# Altium schematic sheet TopLevel.SchDoc: =project_title
size Tabloid; PageSetup: Record=PageOptions|CenterHorizontal=True|CenterVertical=True|PrintScale=0.73|XCorrection=1.00|YCorrection=1.00|PrintKind=0|BorderSize=5000000|LeftOffset=0|BottomOffset=0|Orientation=2|PaperLength=1000|PaperWidth=1000|Scale=100|PaperSource=7|PrintQuality=-4|MediaType=1|DitherType=10|PaperKind=A4|PrintScaleMode=1; CompanyName: Luxonis Holding; Organization: Luxonis Holding; Address1: 1925 Harmony Park Drive; Address2: Westminster, CO; Address3: 80234; Address4: United States; SheetNumber: 2; SheetTotal: 9
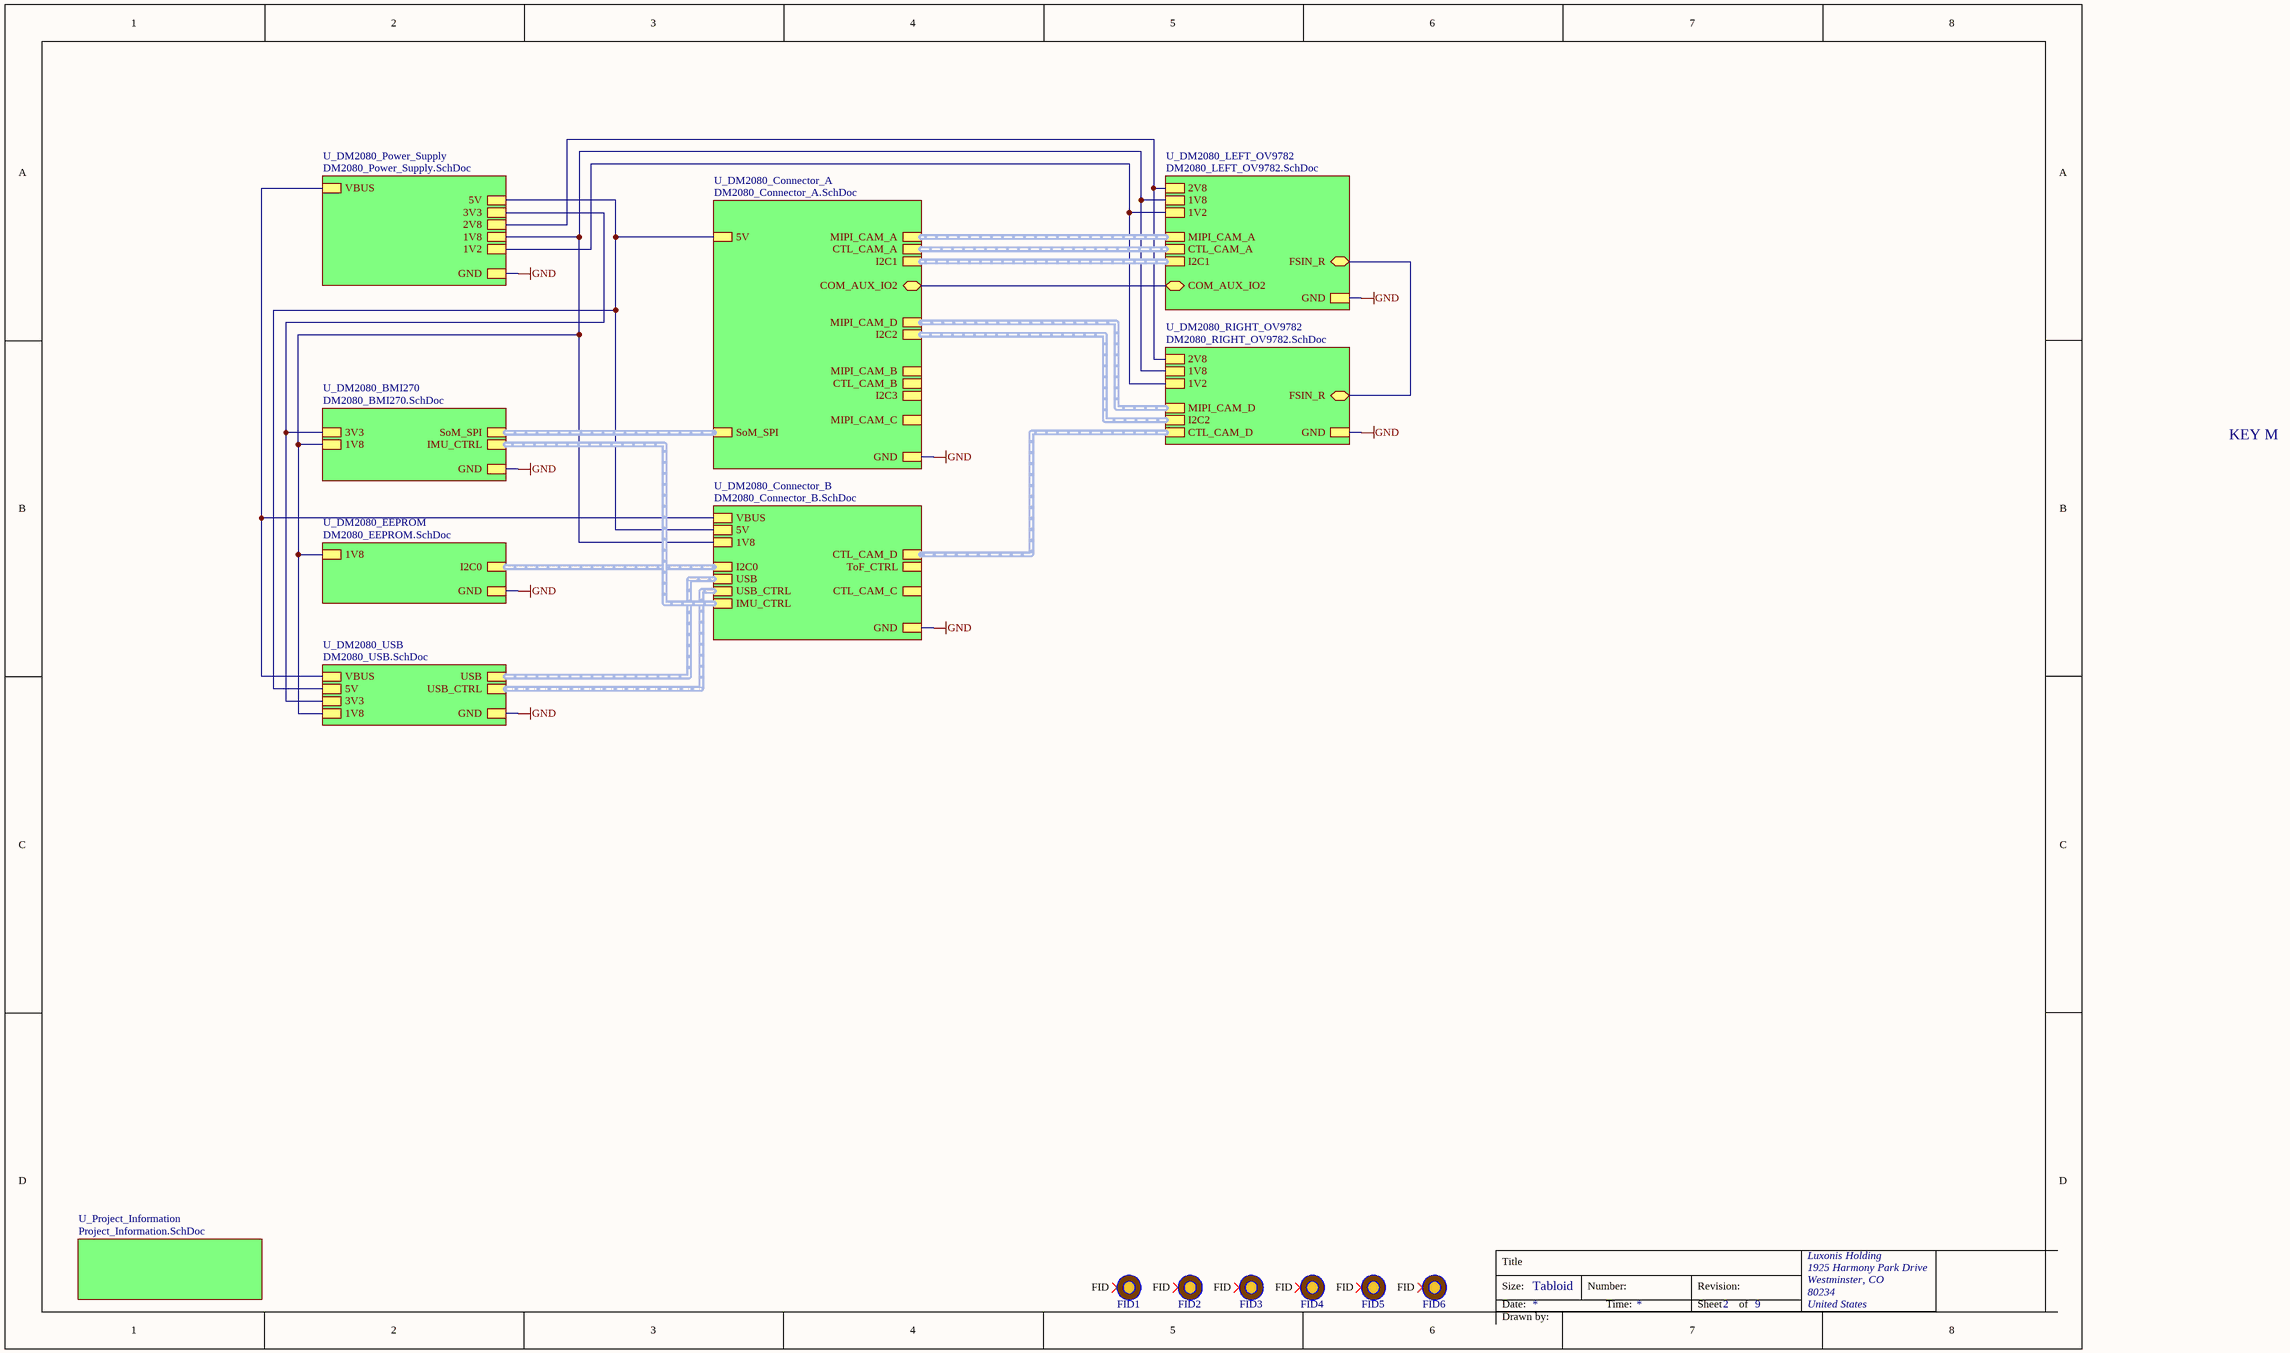
[diagram p0: TopLevel.SchDoc]

## Parts
FID1  FIDUCIAL_ROUND_1MM  [FIDUCIAL_ROUND_1MM]  (value not drawn)  (no BOM)
FID2  FIDUCIAL_ROUND_1MM  [FIDUCIAL_ROUND_1MM]  (value not drawn)  (no BOM)
FID3  FIDUCIAL_ROUND_1MM  [FIDUCIAL_ROUND_1MM]  (value not drawn)  (no BOM)
FID4  FIDUCIAL_ROUND_1MM  [FIDUCIAL_ROUND_1MM]  (value not drawn)  (no BOM)
FID5  FIDUCIAL_ROUND_1MM  [FIDUCIAL_ROUND_1MM]  (value not drawn)  (no BOM)
FID6  FIDUCIAL_ROUND_1MM  [FIDUCIAL_ROUND_1MM]  (value not drawn)  (no BOM)

## Sub-sheets
U_DM2080_BMI270 = DM2080_BMI270.SchDoc: GND, 3V3, 1V8, SoM_SPI (harness MX_SPI0), IMU_CTRL (harness IMU_CTRL)
U_DM2080_Connector_A = DM2080_Connector_A.SchDoc: MIPI_CAM_B (harness MIPI_CAM_B), I2C1 (harness I2C1), CTL_CAM_B (harness CTL_CAM_B), I2C2 (harness I2C2), MIPI_CAM_A (harness MIPI_CAM_A), CTL_CAM_A (harness CTL_CAM_A), MIPI_CAM_D (harness MIPI_CAM_D), COM_AUX_IO2 (bidir), I2C3 (harness I2C3), SoM_SPI (harness SoM_SPI), GND, MIPI_CAM_C (harness MIPI_CAM_C), 5V
U_DM2080_Connector_B = DM2080_Connector_B.SchDoc: 5V, GND, USB (harness USB_KB), 1V8, I2C0 (harness I2C0), IMU_CTRL (harness IMU_CTRL), ToF_CTRL (harness ToF_CTRL), USB_CTRL (harness USB_CTRL), CTL_CAM_D (harness CTL_CAM_D), VBUS, CTL_CAM_C (harness CTL_CAM_C)
U_DM2080_EEPROM = DM2080_EEPROM.SchDoc: 1V8, GND, I2C0 (harness I2C0)
U_DM2080_LEFT_OV9782 = DM2080_LEFT_OV9782.SchDoc: 1V2, 2V8, GND, 1V8, MIPI_CAM_A (harness MIPI_CAM_A), I2C1 (harness I2C1), CTL_CAM_A (harness CTL_CAM_A), COM_AUX_IO2 (bidir), FSIN_R (bidir)
U_DM2080_Power_Supply = DM2080_Power_Supply.SchDoc: 1V2, 2V8, GND, 3V3, 5V, VBUS, 1V8
U_DM2080_RIGHT_OV9782 = DM2080_RIGHT_OV9782.SchDoc: 1V2, 2V8, GND, 1V8, MIPI_CAM_D (harness MIPI_CAM_D), I2C2 (harness I2C2), CTL_CAM_D (harness CTL_CAM_A), FSIN_R (bidir)
U_DM2080_USB = DM2080_USB.SchDoc: USB (harness USB), VBUS, GND, 3V3, 5V, USB_CTRL (harness USB_CTRL), 1V8
U_Project_Information = Project_Information.SchDoc: no entries

## Nets
GND: sheet U_DM2080_BMI270/GND, sheet U_DM2080_Connector_A/GND, sheet U_DM2080_Connector_B/GND, sheet U_DM2080_LEFT_OV9782/GND, sheet U_DM2080_Power_Supply/GND, sheet U_DM2080_RIGHT_OV9782/GND, sheet U_DM2080_USB/GND, sheet U_DM2080_EEPROM/GND
(unnamed): sheet U_DM2080_BMI270/3V3, sheet U_DM2080_Power_Supply/3V3, sheet U_DM2080_USB/3V3
(unnamed): sheet U_DM2080_BMI270/1V8, sheet U_DM2080_Connector_B/1V8, sheet U_DM2080_LEFT_OV9782/1V8, sheet U_DM2080_Power_Supply/1V8, sheet U_DM2080_RIGHT_OV9782/1V8, sheet U_DM2080_USB/1V8, sheet U_DM2080_EEPROM/1V8
(unnamed): sheet U_DM2080_Connector_A/COM_AUX_IO2, sheet U_DM2080_LEFT_OV9782/COM_AUX_IO2
(unnamed): sheet U_DM2080_Connector_A/5V, sheet U_DM2080_Connector_B/5V, sheet U_DM2080_Power_Supply/5V, sheet U_DM2080_USB/5V
(unnamed): sheet U_DM2080_Connector_B/VBUS, sheet U_DM2080_Power_Supply/VBUS, sheet U_DM2080_USB/VBUS
(unnamed): sheet U_DM2080_LEFT_OV9782/1V2, sheet U_DM2080_Power_Supply/1V2, sheet U_DM2080_RIGHT_OV9782/1V2
(unnamed): sheet U_DM2080_LEFT_OV9782/2V8, sheet U_DM2080_Power_Supply/2V8, sheet U_DM2080_RIGHT_OV9782/2V8
(unnamed): sheet U_DM2080_LEFT_OV9782/FSIN_R, sheet U_DM2080_RIGHT_OV9782/FSIN_R

Not connected (* = marked no-connect by the designer): FID1 FID*; FID2 FID*; FID3 FID*; FID4 FID*; FID5 FID*; FID6 FID*

## Buses and harness runs
harness sheet U_DM2080_BMI270/IMU_CTRL = sheet U_DM2080_Connector_B/IMU_CTRL
harness sheet U_DM2080_BMI270/SoM_SPI = sheet U_DM2080_Connector_A/SoM_SPI
harness sheet U_DM2080_Connector_A/CTL_CAM_A = sheet U_DM2080_LEFT_OV9782/CTL_CAM_A
harness sheet U_DM2080_Connector_A/I2C1 = sheet U_DM2080_LEFT_OV9782/I2C1
harness sheet U_DM2080_Connector_A/I2C2 = sheet U_DM2080_RIGHT_OV9782/I2C2
harness sheet U_DM2080_Connector_A/MIPI_CAM_A = sheet U_DM2080_LEFT_OV9782/MIPI_CAM_A
harness sheet U_DM2080_Connector_A/MIPI_CAM_D = sheet U_DM2080_RIGHT_OV9782/MIPI_CAM_D
harness sheet U_DM2080_Connector_B/CTL_CAM_D = sheet U_DM2080_RIGHT_OV9782/CTL_CAM_D
harness sheet U_DM2080_Connector_B/I2C0 = sheet U_DM2080_EEPROM/I2C0
harness sheet U_DM2080_Connector_B/USB = sheet U_DM2080_USB/USB
harness sheet U_DM2080_Connector_B/USB_CTRL = sheet U_DM2080_USB/USB_CTRL

## Notes on the sheet
- KEY M
- Title
- Size:
- Date:
- Tabloid
- Number:
- Time:
- Revision:
- Sheet
- of
- Drawn by:

## Library data of the parts
FID1-FID6 = FIDUCIAL: Fiducial with various available footprints